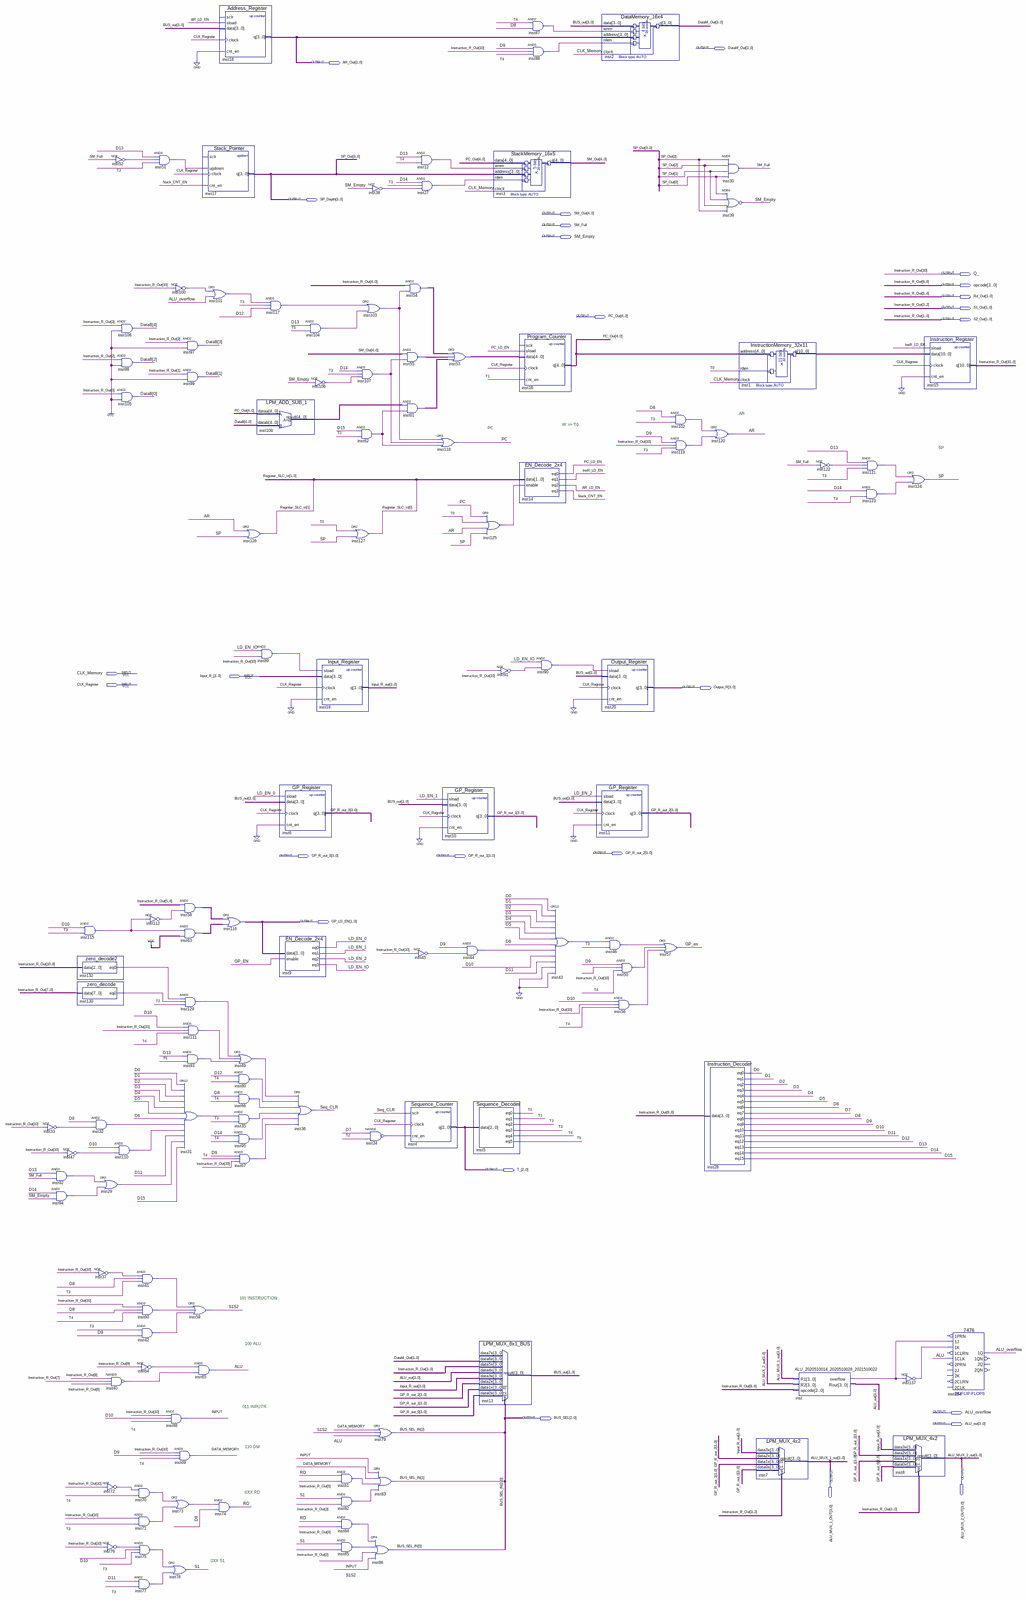
[diagram p0: schematic sheet, whole]
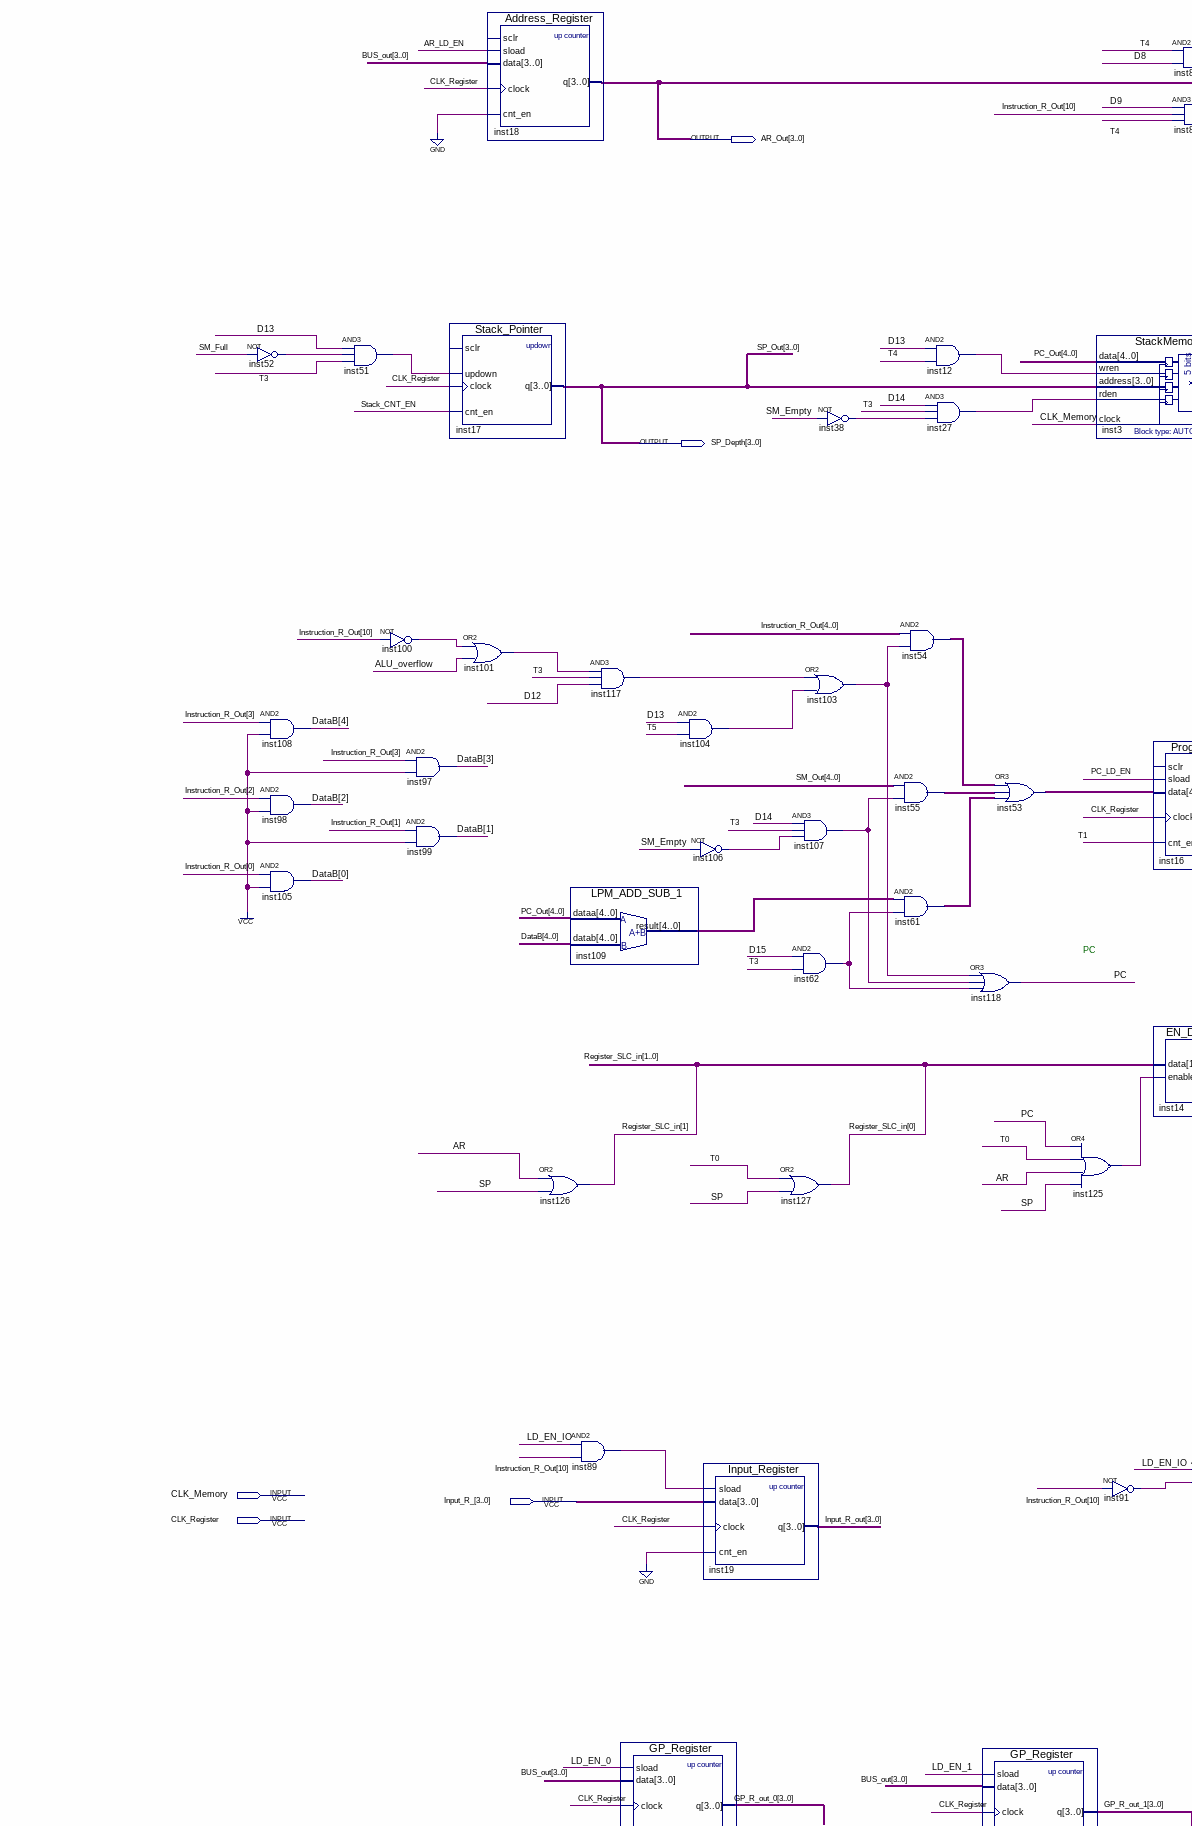
[diagram p1: schematic sheet, upper left part]
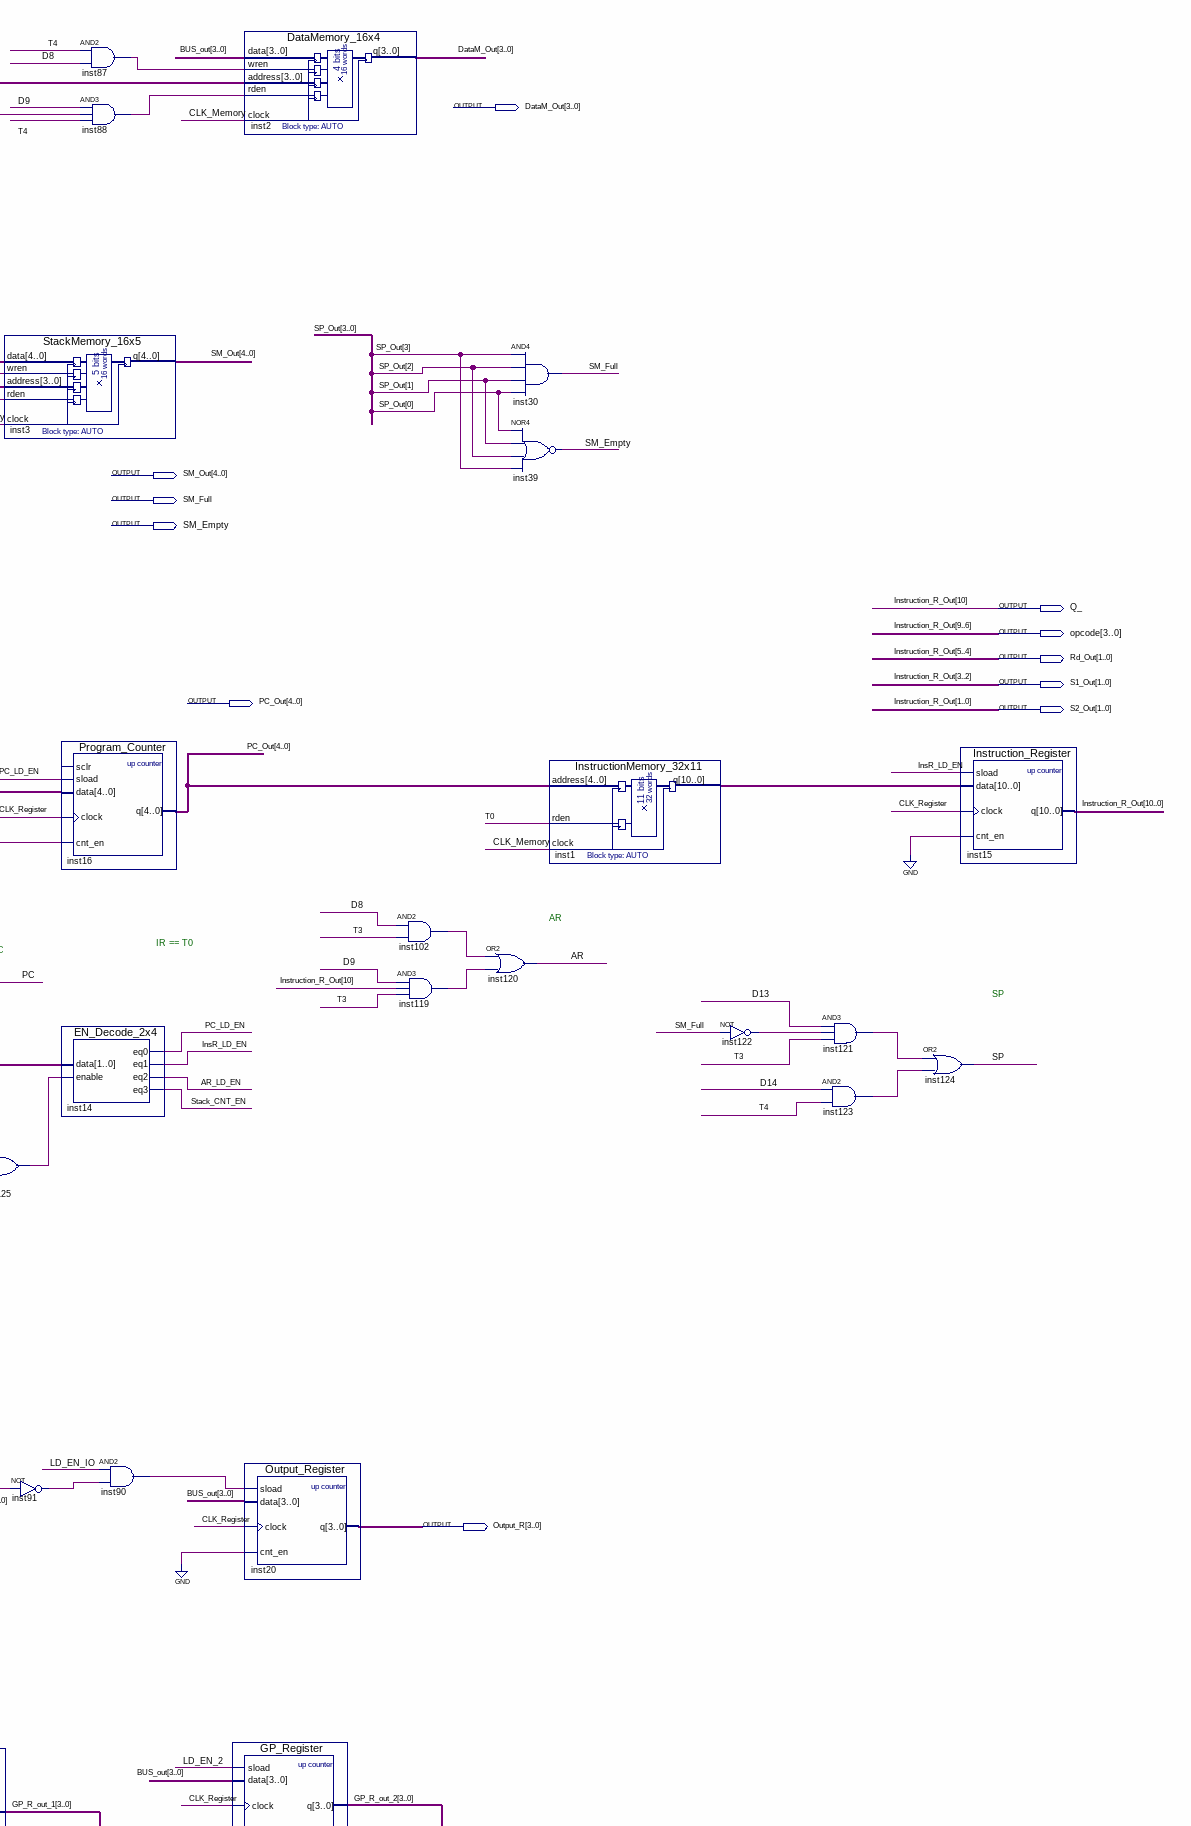
[diagram p2: schematic sheet, upper right part]
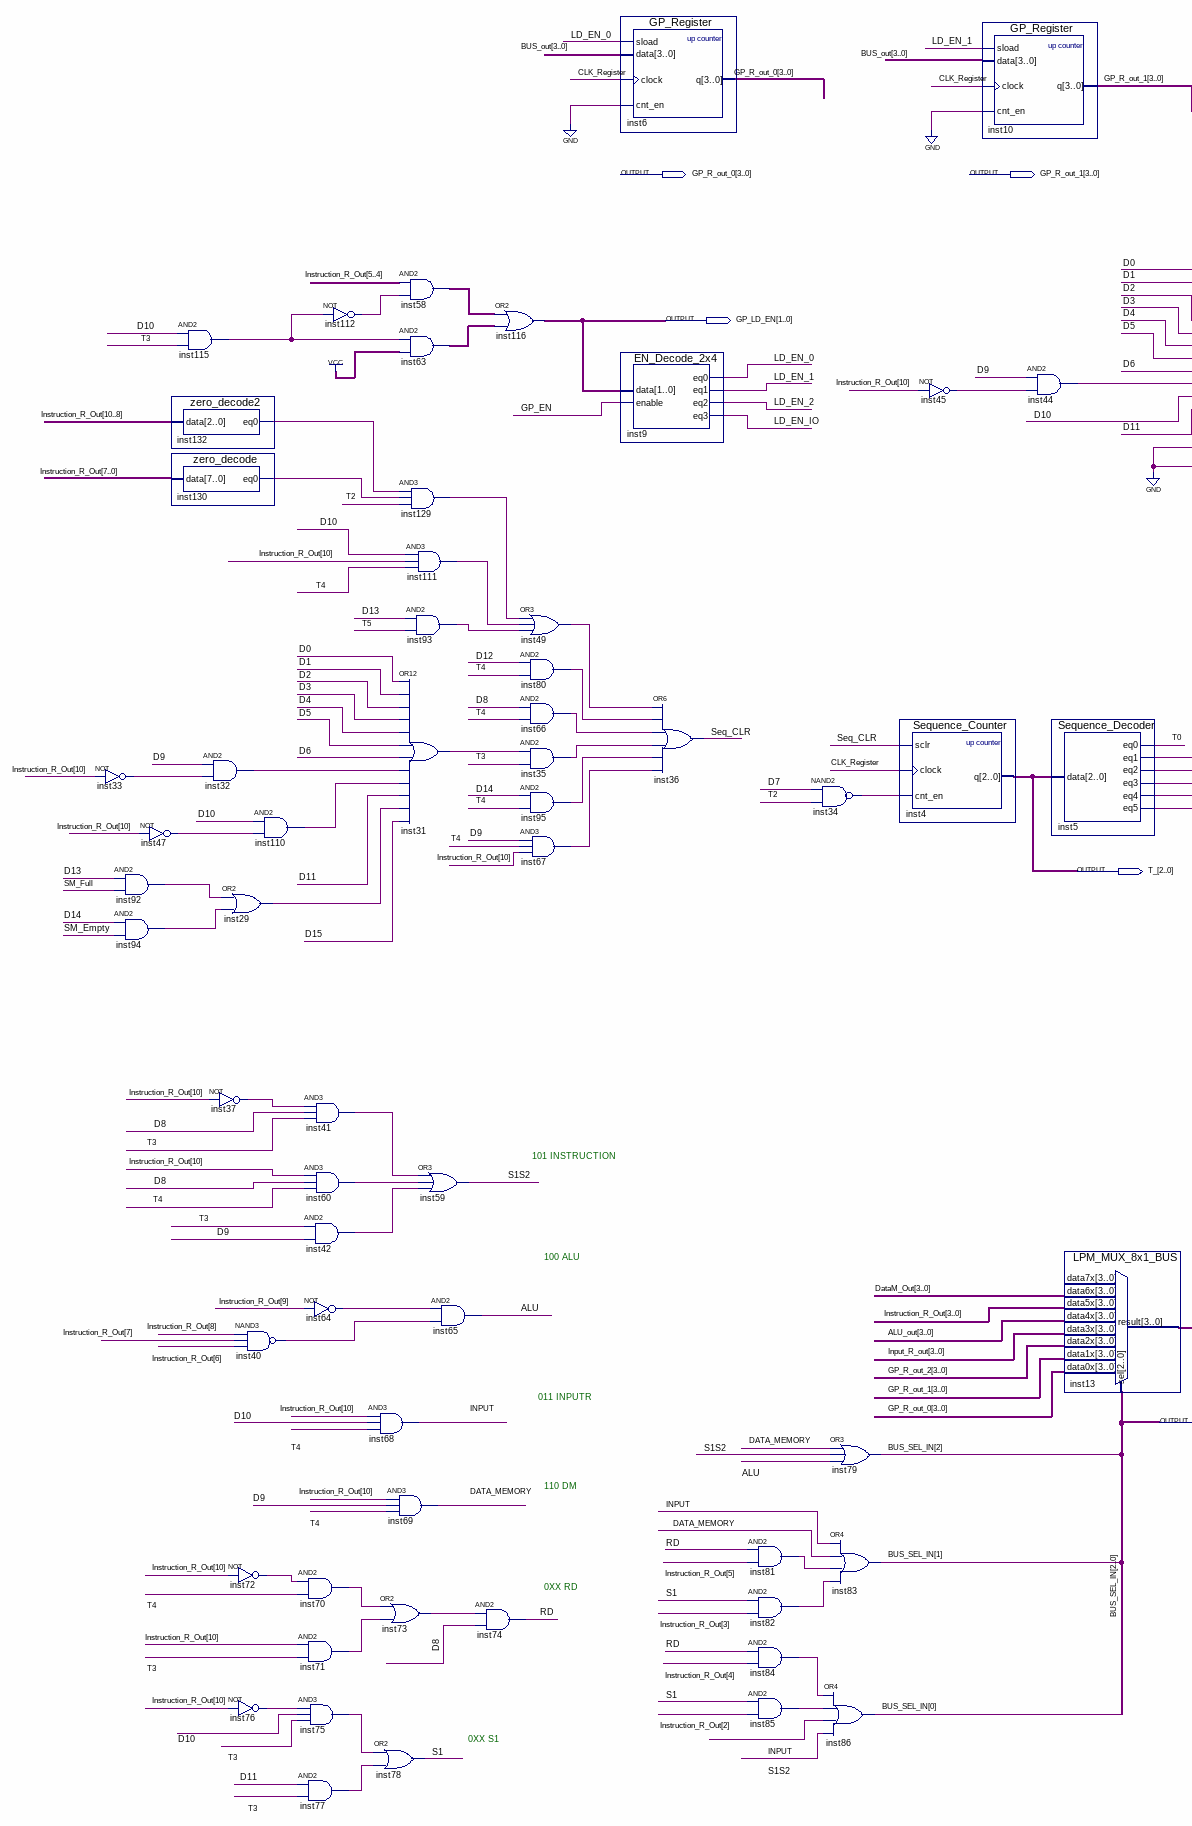
[diagram p3: schematic sheet, lower left part]
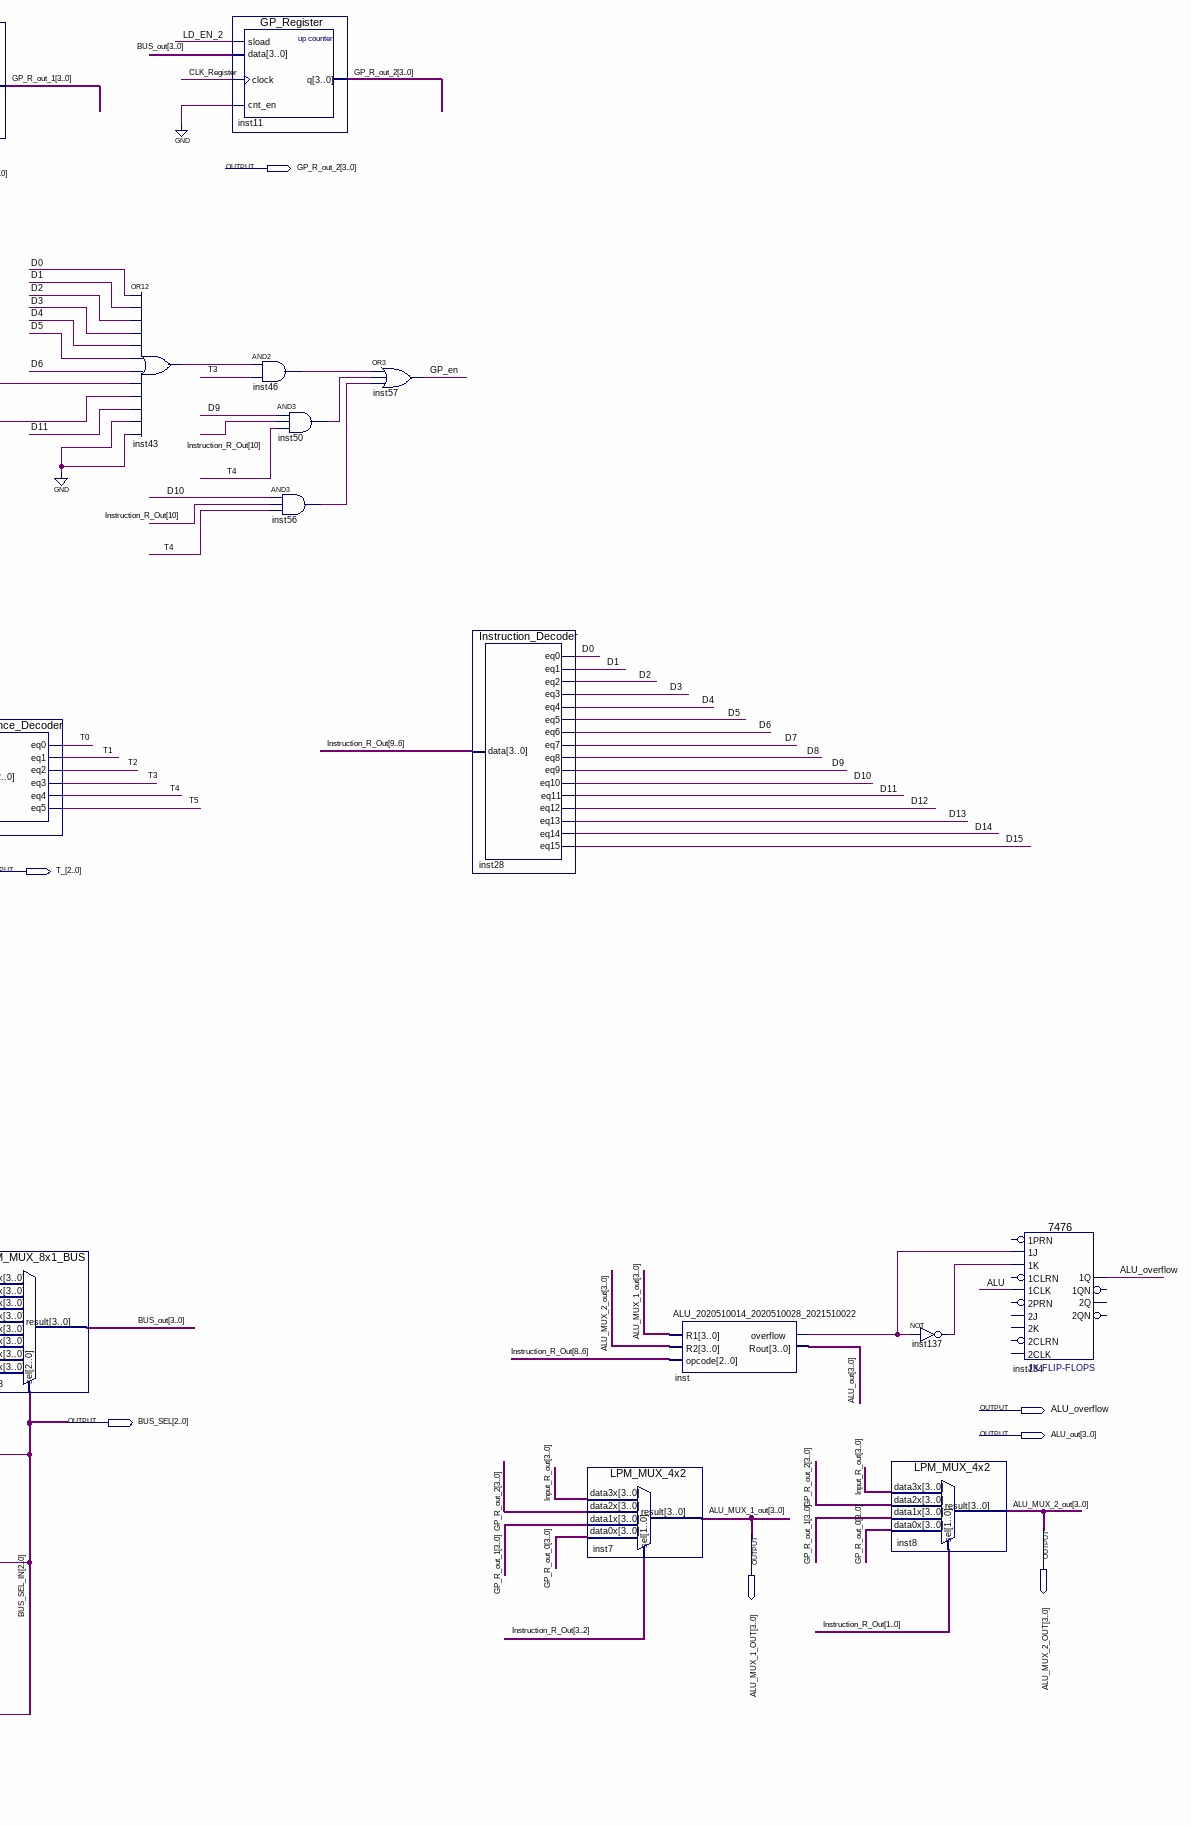
[diagram p4: schematic sheet, lower right part]
// Quartus schematic BUS_2020510014_2020510028_2021510022.bdf as structural Verilog: 123 symbols, 26 pins
module BUS_2020510014_2020510028_2021510022 (
  input  CLK_Memory,
  input  [3:0] Input_R_,
  input  CLK_Register,
  output [3:0] DataM_Out,
  output [3:0] AR_Out,
  output [3:0] SP_Depth,
  output [4:0] SM_Out,
  output SM_Full,
  output SM_Empty,
  output Q_,
  output [3:0] opcode,
  output [1:0] Rd_Out,
  output [1:0] S1_Out,
  output [4:0] PC_Out,
  output [1:0] S2_Out,
  output [3:0] Output_R,
  output [3:0] GP_R_out_2,
  output [3:0] GP_R_out_0,
  output [3:0] GP_R_out_1,
  output [1:0] GP_LD_EN,
  output [2:0] T_,
  output ALU_overflow,
  output [2:0] BUS_SEL,
  output [3:0] ALU_out,
  output [3:0] ALU_MUX_2_OUT,
  output [3:0] ALU_MUX_1_OUT
);

  wire ALU, AR, AR_LD_EN, D0, D1, D2, D3, D4, D5, D6, D7, D8, D9, D10, D11, D12, D13, D14, D15, DATA_MEMORY,
       GP_EN, INPUT, InsR_LD_EN, inst12_out, inst27_out, inst29_out, inst31_out, inst32_out, inst33_out,
       inst34_out, inst35_out, inst37_out, inst38_out, inst40_out, inst41_out, inst42_out, inst43_out,
       inst44_out, inst45_out, inst46_out, inst47_out, inst49_out, inst50_out, inst51_out, inst52_out,
       inst56_out, inst60_out, inst62_out, inst64_out, inst66_out, inst67_out, inst70_out, inst71_out,
       inst72_out, inst73_out, inst75_out, inst76_out, inst77_out, inst80_out, inst81_out, inst82_out,
       inst84_out, inst85_out, inst87_out, inst88_out, inst89_out, inst90_out, inst91_out, inst92_out,
       inst93_out, inst94_out, inst95_out, inst100_out, inst101_out, inst102_out, inst103_out, inst104_out,
       inst106_out, inst107_out, inst110_out, inst111_out, inst112_out, inst115_out, inst117_out,
       inst119_out, inst121_out, inst122_out, inst123_out, inst125_out, inst129_out, inst130_eq0,
       inst132_eq0, inst137_out, inst_overflow, LD_EN_0, LD_EN_1, LD_EN_2, LD_EN_IO, PC, PC_LD_EN, RD, S1,
       S1S2, Seq_CLR, SP, Stack_CNT_EN, T0, T1, T2, T3, T4, T5;
  wire [1:0] inst58_out, inst63_out, Register_SLC_in;
  wire [3:0] BUS_out, Input_R_out;
  wire [4:0] DataB, inst53_out, inst54_out, inst55_out, inst61_out, inst109_result;
  wire [10:0] inst1_q;

  not inst33 (inst33_out, Q_);
  and inst92 (inst92_out, D13, SM_Full);
  and inst94 (inst94_out, D14, SM_Empty);
  zero_decode2 inst132 (.data({Q_, opcode[3:2]}), .eq0(inst132_eq0));
  zero_decode inst130 (.data({opcode[1:0], Rd_Out, S1_Out, S2_Out}), .eq0(inst130_eq0));
  not inst47 (inst47_out, Q_);
  and inst115 (inst115_out, D10, T3);
  and inst32 (inst32_out, D9, inst33_out);
  or inst29 (inst29_out, inst92_out, inst94_out);
  not inst37 (inst37_out, Q_);
  not inst52 (inst52_out, SM_Full);
  and inst108 (DataB[4], S1_Out[1], 1'b1);
  and inst98 (DataB[2], S1_Out[0], 1'b1);
  and inst105 (DataB[0], S2_Out[0], 1'b1);
  and inst110 (inst110_out, D10, inst47_out);
  nand inst40 (inst40_out, opcode[2], opcode[1], opcode[0]);
  not inst72 (inst72_out, Q_);
  not inst76 (inst76_out, Q_);
  not inst112 (inst112_out, inst115_out);
  and inst41 (inst41_out, inst37_out, D8, T3);
  and inst60 (inst60_out, Q_, D8, T4);
  and inst42 (inst42_out, T3, D9);
  not inst64 (inst64_out, opcode[3]);
  and inst70 (inst70_out, inst72_out, T4);
  and inst71 (inst71_out, Q_, T3);
  and inst75 (inst75_out, inst76_out, D10, T3);
  and inst77 (inst77_out, D11, T3);
  and inst51 (inst51_out, D13, inst52_out, T3);
  and inst68 (INPUT, Q_, D10, T4);
  or inst78 (S1, inst75_out, inst77_out);
  not inst100 (inst100_out, Q_);
  and inst97 (DataB[3], S1_Out[1], 1'b1);
  and inst99 (DataB[1], S2_Out[1], 1'b1);
  assign inst58_out = Rd_Out & {2{inst112_out}};  // AND2 inst58, 2 bits wide
  assign inst63_out = {2{inst115_out}} & 2'b11;  // AND2 inst63, 2 bits wide
  and inst129 (inst129_out, inst132_eq0, inst130_eq0, T2);
  and inst111 (inst111_out, D10, Q_, T4);
  and inst93 (inst93_out, D13, T5);
  or inst31 (inst31_out, D0, D1, D2, D3, D4, D5, D6, inst32_out, inst110_out, D11, inst29_out, D15);
  or inst59 (S1S2, inst41_out, inst60_out, inst42_out);
  and inst69 (DATA_MEMORY, Q_, D9, T4);
  or inst73 (inst73_out, inst70_out, inst71_out);
  Stack_Pointer inst17 (.updown(inst51_out), .clock(CLK_Register), .cnt_en(Stack_CNT_EN), .q(SP_Depth));  // open: sclr
  or inst101 (inst101_out, inst100_out, ALU_overflow);
  and inst65 (ALU, inst64_out, inst40_out);
  and inst74 (RD, inst73_out, D8);
  Address_Register inst18 (
    .sload(AR_LD_EN), .data(BUS_out), .clock(CLK_Register), .cnt_en(1'b0), .q(AR_Out));  // open: sclr
  assign GP_LD_EN = inst58_out | inst63_out;  // OR2 inst116, 2 bits wide
  or inst49 (inst49_out, inst129_out, inst111_out, inst93_out);
  and inst80 (inst80_out, D12, T4);
  and inst66 (inst66_out, D8, T4);
  and inst35 (inst35_out, inst31_out, T3);
  and inst95 (inst95_out, D14, T4);
  and inst67 (inst67_out, D9, T4, Q_);
  LPM_ADD_SUB_1 inst109 (.dataa(PC_Out), .datab(DataB), .result(inst109_result));
  or inst126 (Register_SLC_in[1], AR, SP);
  and inst89 (inst89_out, LD_EN_IO, Q_);
  and inst117 (inst117_out, inst101_out, T3, D12);
  GP_Register inst6 (.sload(LD_EN_0), .data(BUS_out), .clock(CLK_Register), .cnt_en(1'b0), .q(GP_R_out_0));
  EN_Decode_2x4 inst9 (.data(GP_LD_EN), .enable(GP_EN), .eq0(LD_EN_0), .eq1(LD_EN_1), .eq2(LD_EN_2), .eq3(LD_EN_IO));
  and inst104 (inst104_out, D13, T5);
  or inst36 (Seq_CLR, inst49_out, inst80_out, inst66_out, inst35_out, inst95_out, inst67_out);
  not inst106 (inst106_out, SM_Empty);
  Input_Register inst19 (.sload(inst89_out), .data(Input_R_), .clock(CLK_Register), .cnt_en(1'b0), .q(Input_R_out));
  or inst127 (Register_SLC_in[0], T0, SP);
  and inst81 (inst81_out, RD, Rd_Out[1]);
  and inst82 (inst82_out, S1, S1_Out[1]);
  and inst84 (inst84_out, RD, Rd_Out[0]);
  and inst85 (inst85_out, S1, S1_Out[0]);
  not inst38 (inst38_out, SM_Empty);
  or inst103 (inst103_out, inst117_out, inst104_out);
  and inst107 (inst107_out, D14, T3, inst106_out);
  and inst62 (inst62_out, D15, T3);
  nand inst34 (inst34_out, D7, T2);
  or inst79 (BUS_SEL[2], DATA_MEMORY, S1S2, ALU);
  or inst83 (BUS_SEL[1], INPUT, DATA_MEMORY, inst81_out, inst82_out);
  or inst86 (BUS_SEL[0], inst84_out, inst85_out, INPUT, S1S2);
  and inst12 (inst12_out, D13, T4);
  and inst27 (inst27_out, D14, T3, inst38_out);
  assign inst54_out = {Rd_Out[0], S1_Out, S2_Out} & {5{inst103_out}};  // AND2 inst54, 5 bits wide
  assign inst55_out = SM_Out & {5{inst107_out}};  // AND2 inst55, 5 bits wide
  assign inst61_out = inst109_result & {5{inst62_out}};  // AND2 inst61, 5 bits wide
  not inst45 (inst45_out, Q_);
  Sequence_Counter inst4 (.sclr(Seq_CLR), .clock(CLK_Register), .cnt_en(inst34_out), .q(T_));
  or inst118 (PC, inst103_out, inst107_out, inst62_out);
  GP_Register inst10 (.sload(LD_EN_1), .data(BUS_out), .clock(CLK_Register), .cnt_en(1'b0), .q(GP_R_out_1));
  assign inst53_out = inst54_out | inst55_out | inst61_out;  // OR3 inst53, 5 bits wide
  and inst44 (inst44_out, D9, inst45_out);
  or inst125 (inst125_out, PC, T0, AR, SP);
  Sequence_Decoder inst5 (.data(T_), .eq0(T0), .eq1(T1), .eq2(T2), .eq3(T3), .eq4(T4), .eq5(T5));
  LPM_MUX_8x1_BUS inst13 (
    .data6x(DataM_Out), .data5x({S1_Out, S2_Out}), .data4x(ALU_out), .data3x(Input_R_out),
    .data2x(GP_R_out_2), .data1x(GP_R_out_1), .data0x(GP_R_out_0), .sel(BUS_SEL), .result(BUS_out));  // open: data7x
  StackMemory_16x5 inst3 (
    .data(PC_Out), .wren(inst12_out), .address(SP_Depth), .rden(inst27_out), .clock(CLK_Memory), .q(SM_Out));
  not inst91 (inst91_out, Q_);
  and inst87 (inst87_out, T4, D8);
  and inst88 (inst88_out, D9, Q_, T4);
  Program_Counter inst16 (
    .sload(PC_LD_EN), .data(inst53_out), .clock(CLK_Register), .cnt_en(T1), .q(PC_Out));  // open: sclr
  EN_Decode_2x4 inst14 (
    .data(Register_SLC_in), .enable(inst125_out), .eq0(PC_LD_EN), .eq1(InsR_LD_EN), .eq2(AR_LD_EN),
    .eq3(Stack_CNT_EN));
  and inst90 (inst90_out, LD_EN_IO, inst91_out);
  or inst43 (inst43_out, D0, D1, D2, D3, D4, D5, D6, inst44_out, D10, D11, 1'b0, 1'b0);
  DataMemory_16x4 inst2 (
    .data(BUS_out), .wren(inst87_out), .address(AR_Out), .rden(inst88_out), .clock(CLK_Memory), .q(DataM_Out));
  Output_Register inst20 (.sload(inst90_out), .data(BUS_out), .clock(CLK_Register), .cnt_en(1'b0), .q(Output_R));
  GP_Register inst11 (.sload(LD_EN_2), .data(BUS_out), .clock(CLK_Register), .cnt_en(1'b0), .q(GP_R_out_2));
  and inst46 (inst46_out, inst43_out, T3);
  and inst50 (inst50_out, D9, Q_, T4);
  and inst56 (inst56_out, D10, Q_, T4);
  and inst102 (inst102_out, D8, T3);
  and inst119 (inst119_out, D9, Q_, T3);
  or inst57 (GP_EN, inst46_out, inst50_out, inst56_out);
  or inst120 (AR, inst102_out, inst119_out);
  Instruction_Decoder inst28 (
    .data(opcode), .eq0(D0), .eq1(D1), .eq2(D2), .eq3(D3), .eq4(D4), .eq5(D5), .eq6(D6), .eq7(D7), .eq8(D8),
    .eq9(D9), .eq10(D10), .eq11(D11), .eq12(D12), .eq13(D13), .eq14(D14), .eq15(D15));
  and inst30 (SM_Full, SP_Depth[3], SP_Depth[2], SP_Depth[1], SP_Depth[0]);
  nor inst39 (SM_Empty, SP_Depth[0], SP_Depth[1], SP_Depth[2], SP_Depth[3]);
  InstructionMemory_32x11 inst1 (.address(PC_Out), .rden(T0), .clock(CLK_Memory), .q(inst1_q));
  LPM_MUX_4x2 inst7 (
    .data3x(Input_R_out), .data2x(GP_R_out_2), .data1x(GP_R_out_1), .data0x(GP_R_out_0), .sel(S1_Out),
    .result(ALU_MUX_1_OUT));
  ALU_2020510014_2020510028_2021510022 inst (
    .R1(ALU_MUX_1_OUT), .R2(ALU_MUX_2_OUT), .opcode(opcode[2:0]), .overflow(inst_overflow), .Rout(ALU_out));
  not inst122 (inst122_out, SM_Full);
  and inst121 (inst121_out, D13, inst122_out, T3);
  and inst123 (inst123_out, D14, T4);
  LPM_MUX_4x2 inst8 (
    .data3x(Input_R_out), .data2x(GP_R_out_2), .data1x(GP_R_out_1), .data0x(GP_R_out_0), .sel(S2_Out),
    .result(ALU_MUX_2_OUT));
  or inst124 (SP, inst121_out, inst123_out);
  not inst137 (inst137_out, inst_overflow);
  Instruction_Register inst15 (
    .sload(InsR_LD_EN), .data(inst1_q), .clock(CLK_Register), .cnt_en(1'b0),
    .q({Q_, opcode, Rd_Out, S1_Out, S2_Out}));
  \7476  inst134 (
    .\1J (inst_overflow), .\1K (inst137_out), .\1CLK (ALU), .\1Q (ALU_overflow));  // open: 1PRN, 2PRN, 2J, 1CLRN, 2K, 2CLRN, 2CLK, 2QN, 2Q, 1QN

  // Other names for the same wires on the sheet: BUS_SEL_IN[2:0] = BUS_SEL;
  //   Instruction_R_Out[10:0] = {Q_, opcode, Rd_Out, S1_Out, S2_Out}; SP_Out[3:0] = SP_Depth

  // Notes on the sheet:
  //   AR
  //   IR == T0
  //   PC
  //   SP
  //   101 INSTRUCTION
  //   100 ALU
  //   011 INPUTR
  //   110 DM
  //   0XX RD
  //   0XX S1
endmodule
